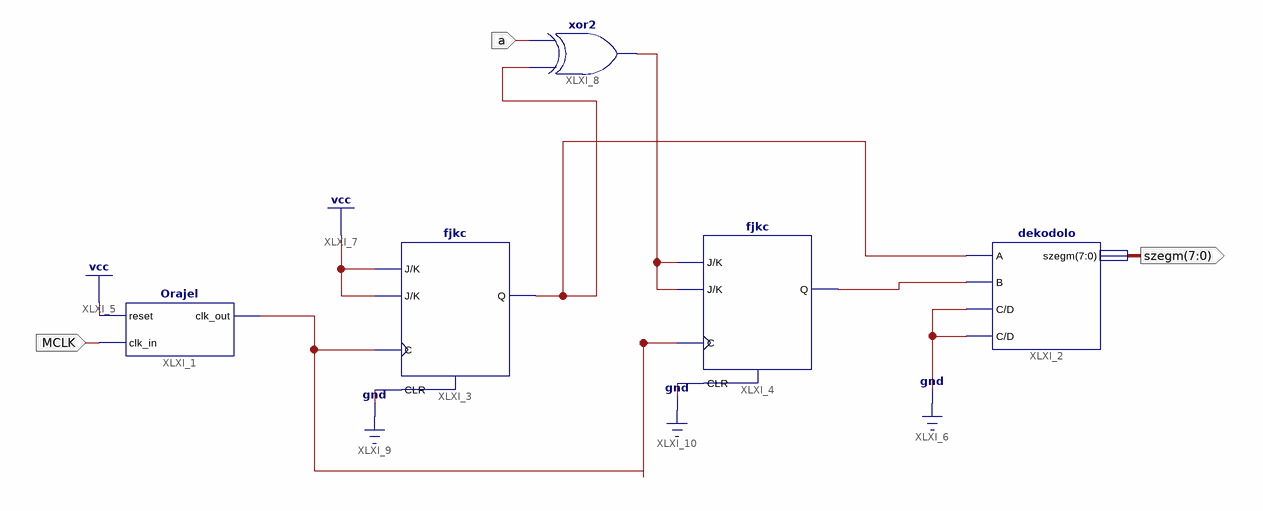
[diagram p0: schematic sheet 1]
// Xilinx ISE schematic JKszamlalo.sch (spartan3e) as structural Verilog: 5 symbols, 3 ports
module JKszamlalo (
  input  MCLK,
  input  a,
  output [7:0] szegm
);

  wire XLXN_5, XLXN_8, XLXN_9, XLXN_13;

  Orajel XLXI_1 (.reset(1'b1), .clk_in(MCLK), .clk_out(XLXN_5));
  dekodolo XLXI_2 (.A(XLXN_9), .B(XLXN_8), .C(1'b0), .D(1'b0), .szegm(szegm));
  fjkc XLXI_3 (.C(XLXN_5), .CLR(1'b0), .J(1'b1), .K(1'b1), .Q(XLXN_9));
  fjkc XLXI_4 (.C(XLXN_5), .CLR(1'b0), .J(XLXN_13), .K(XLXN_13), .Q(XLXN_8));
  xor XLXI_8 (XLXN_13, XLXN_9, a);
endmodule
